# Altium schematic sheet AnalogSigCond.SchDoc: Analog Signal Front-End
size Letter; Engineer: Nathan Petersen; DocumentNumber: 14; Revision: v1.2; SheetNumber: 14; SheetTotal: 26
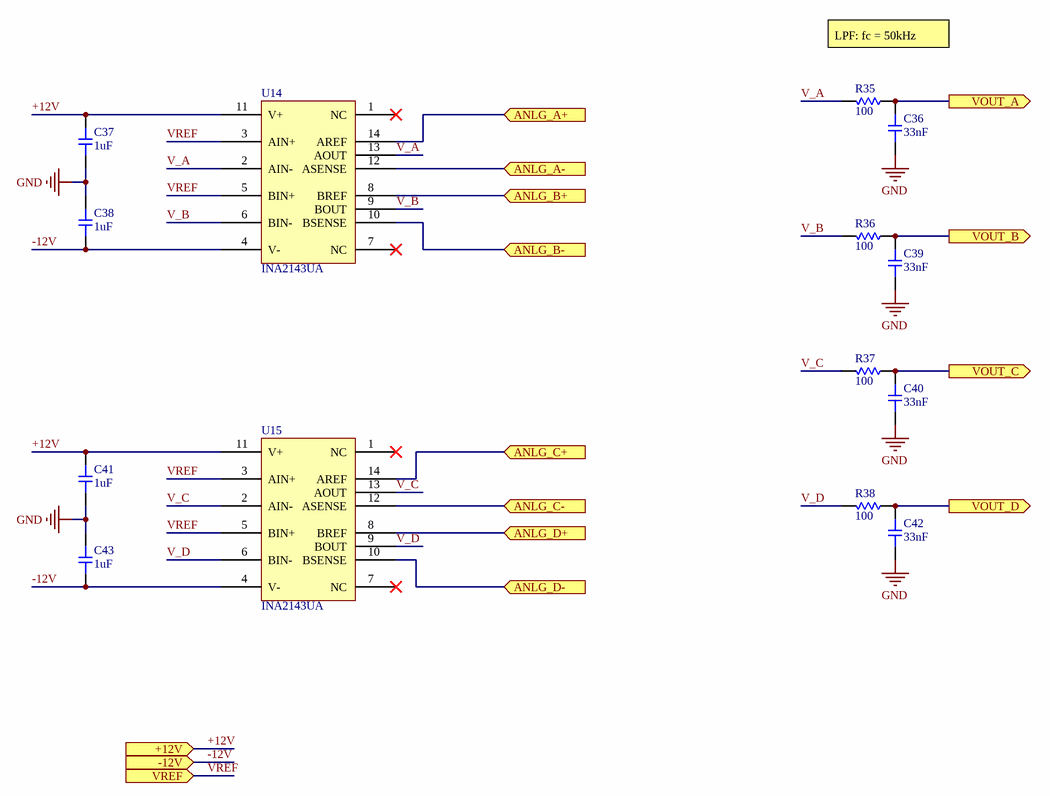
[diagram p0: AnalogSigCond.SchDoc]

## Parts
C36  value 33nF  [0603-CAP]  (hidden comment: Capacitor)
C37  value 1uF  [0603-CAP]  (hidden comment: Capacitor)
C38  value 1uF  [0603-CAP]  (hidden comment: Capacitor)
C39  value 33nF  [0603-CAP]  (hidden comment: Capacitor)
C40  value 33nF  [0603-CAP]  (hidden comment: Capacitor)
C41  value 1uF  [0603-CAP]  (hidden comment: Capacitor)
C42  value 33nF  [0603-CAP]  (hidden comment: Capacitor)
C43  value 1uF  [0603-CAP]  (hidden comment: Capacitor)
R35  value 100  [0603-RES]  (hidden comment: Resistor)
R36  value 100  [0603-RES]  (hidden comment: Resistor)
R37  value 100  [0603-RES]  (hidden comment: Resistor)
R38  value 100  [0603-RES]  (hidden comment: Resistor)
U14  INA2143UA  [SOIC127P600X175-14N]
U15  INA2143UA  [SOIC127P600X175-14N]

## Ports
+12V (in), -12V (in), ANLG_A+ (in), ANLG_A- (in), ANLG_B+ (in), ANLG_B- (in), ANLG_C+ (in), ANLG_C- (in), ANLG_D+ (in), ANLG_D- (in), VOUT_A (out), VOUT_B (out), VOUT_C (out), VOUT_D (out), VREF (in)

## Nets
GND: C36.2 C37.1 C38.2 C39.2 C40.2 C41.1 C42.2 C43.2
+12V: C37.2 C41.2 U14.11(V+) U15.11(V+) ; port +12V
-12V: C38.1 C43.1 U14.4(V-) U15.4(V-) ; port -12V
ANLG_A+: U14.14(AREF) ; port ANLG_A+
ANLG_A-: U14.12(ASENSE) ; port ANLG_A-
ANLG_B+: U14.8(BREF) ; port ANLG_B+
ANLG_B-: U14.10(BSENSE) ; port ANLG_B-
ANLG_C+: U15.14(AREF) ; port ANLG_C+
ANLG_C-: U15.12(ASENSE) ; port ANLG_C-
ANLG_D+: U15.8(BREF) ; port ANLG_D+
ANLG_D-: U15.10(BSENSE) ; port ANLG_D-
V_A: R35.2 U14.2(AIN-) U14.13(AOUT)
V_B: R36.2 U14.6(BIN-) U14.9(BOUT)
V_C: R37.2 U15.2(AIN-) U15.13(AOUT)
V_D: R38.2 U15.6(BIN-) U15.9(BOUT)
VOUT_A: C36.1 R35.1 ; port VOUT_A
VOUT_B: C39.1 R36.1 ; port VOUT_B
VOUT_C: C40.1 R37.1 ; port VOUT_C
VOUT_D: C42.1 R38.1 ; port VOUT_D
VREF: U14.3(AIN+) U14.5(BIN+) U15.3(AIN+) U15.5(BIN+) ; port VREF

Not connected (* = marked no-connect by the designer): U14 1(NC)* 7(NC)*; U15 1(NC)* 7(NC)*

## Notes on the sheet
- LPF: fc = 50kHz
- Title:
- File:
- Sheet:
- of
- Revision:
- Time:
- Date:
- Engineer:

## Library data of the parts
U14 U15 = INA2143UA: IC OPAMP DIFF 150KHZ 14SOIC; Supplier 1: Digi-Key; Supplier Part Number 1: INA2143UA-ND
C36-C43 = Capacitor: Supplier 1: Digi-Key
  C36 C39 C40 C42: Supplier Part Number 1: 478-1548-1-ND
  C37 C38 C41 C43: Supplier Part Number 1: 1276-6524-1-ND
R35-R38 = Resistor: Supplier 1: Digi-Key; Supplier Part Number 1: YAG3561CT-ND